# Altium schematic sheet PA_DUE_BRD_2021-11-28.schdoc
size 82 x 160 mm
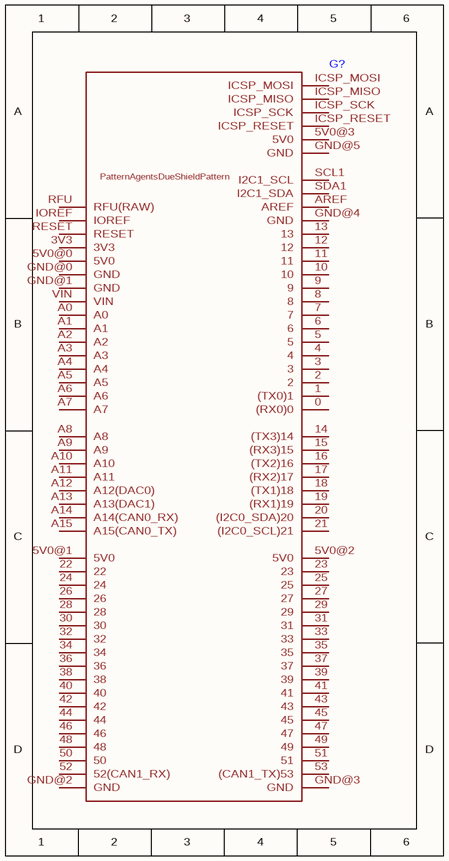
[diagram p0: PA_DUE_BRD_2021-11-28.schdoc]

## Parts
G?  (no value)  [ARDUINO-DUE-SIPPY]

## Nets

Not connected (* = marked no-connect by the designer): G? 0((RX0)0) 1((TX0)1) 2 3 3V3 4 5 5V0@0(5V0) 5V0@1(5V0) 5V0@2(5V0) 5V0@3(5V0) 6 7 8 9 10 11 12 13 14((TX3)14) 15((RX3)15) 16((TX2)16) 17((RX2)17) 18((TX1)18) 19((RX1)19) 20((I2C0_SDA)20) 21((I2C0_SCL)21) 22 23 24 25 26 27 28 29 30 31 32 33 34 35 36 37 38 39 40 41 42 43 44 45 46 47 48 49 50 51 52(52(CAN1_RX)) 53((CAN1_TX)53) A0 A1 A2 A3 A4 A5 A6 A7 A8 A9 A10 A11 A12(A12(DAC0)) A13(A13(DAC1)) A14(A14(CAN0_RX)) A15(A15(CAN0_TX)) AREF GND@0(GND) GND@1(GND) GND@2(GND) GND@3(GND) GND@4(GND) GND@5(GND) ICSP_MISO ICSP_MOSI ICSP_RESET ICSP_SCK IOREF RESET RFU(RFU(RAW)) SCL1(I2C1_SCL) SDA1(I2C1_SDA) VIN

## Notes on the sheet
- (in symbol PA_DUE_BRD) PatternAgentsDueShieldPattern

## Library data of the parts
G? = PA_DUE_BRD